# EAGLE design M900 (EAGLE 6.6.0)
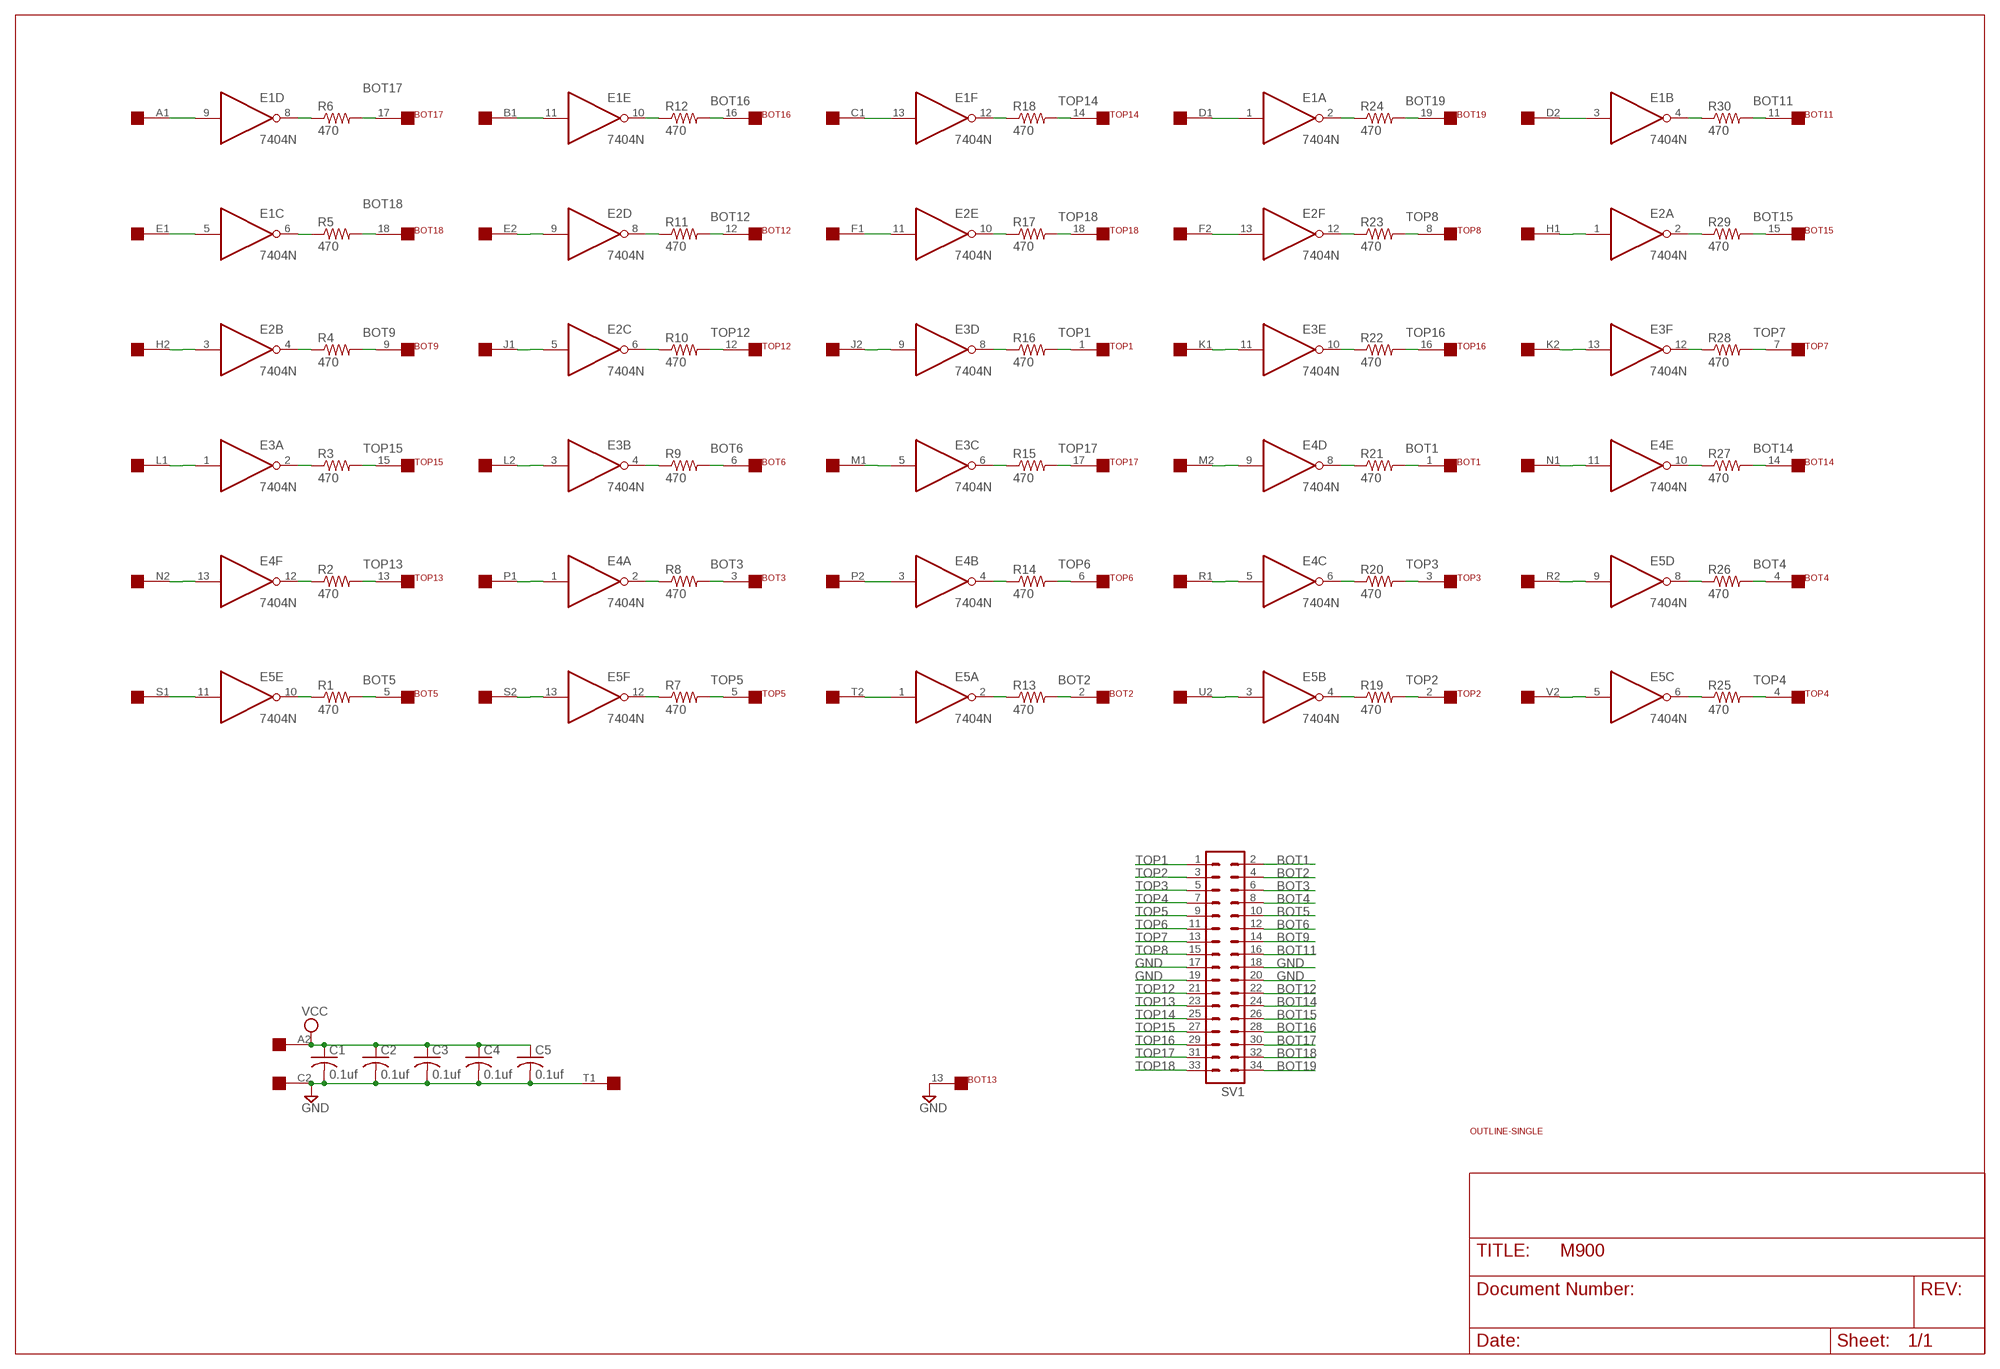
[diagram p0: schematic, sheet 1]

## Parts
BOT  FLEX19  [FLEX19]
C1  0.1uf  C-US050-025X075  [C050-025X075]
C2  0.1uf  C-US050-025X075  [C050-025X075]
C3  0.1uf  C-US050-025X075  [C050-025X075]
C4  0.1uf  C-US050-025X075  [C050-025X075]
C5  0.1uf  C-US050-025X075  [C050-025X075]
E1  7404N  [DIL14]
E2  7404N  [DIL14]
E3  7404N  [DIL14]
E4  7404N  [DIL14]
E5  7404N  [DIL14]
EDGE  SINGLE  [EDGE-CON2]
R1  470  R-US_0207/10  [0207/10]
R2  470  R-US_0207/10  [0207/10]
R3  470  R-US_0207/10  [0207/10]
R4  470  R-US_0207/10  [0207/10]
R5  470  R-US_0207/10  [0207/10]
R6  470  R-US_0207/10  [0207/10]
R7  470  R-US_0207/10  [0207/10]
R8  470  R-US_0207/10  [0207/10]
R9  470  R-US_0207/10  [0207/10]
R10  470  R-US_0207/10  [0207/10]
R11  470  R-US_0207/10  [0207/10]
R12  470  R-US_0207/10  [0207/10]
R13  470  R-US_0207/10  [0207/10]
R14  470  R-US_0207/10  [0207/10]
R15  470  R-US_0207/10  [0207/10]
R16  470  R-US_0207/10  [0207/10]
R17  470  R-US_0207/10  [0207/10]
R18  470  R-US_0207/10  [0207/10]
R19  470  R-US_0207/10  [0207/10]
R20  470  R-US_0207/10  [0207/10]
R21  470  R-US_0207/10  [0207/10]
R22  470  R-US_0207/10  [0207/10]
R23  470  R-US_0207/10  [0207/10]
R24  470  R-US_0207/10  [0207/10]
R25  470  R-US_0207/10  [0207/10]
R26  470  R-US_0207/10  [0207/10]
R27  470  R-US_0207/10  [0207/10]
R28  470  R-US_0207/10  [0207/10]
R29  470  R-US_0207/10  [0207/10]
R30  470  R-US_0207/10  [0207/10]
SV1  MA17-2  [MA17-2]
TOP  FLEX19  [FLEX19]
U$2  OUTLINE-SINGLE  [SINGLE]

## Nets
BOT1: BOT.1 R21.2 SV1.2
BOT2: BOT.2 R13.2 SV1.4
BOT3: BOT.3 R8.2 SV1.6
BOT4: BOT.4 R26.2 SV1.8
BOT5: BOT.5 R1.2 SV1.10
BOT6: BOT.6 R9.2 SV1.12
BOT9: BOT.9 R4.2 SV1.14
BOT11: BOT.11 R30.2 SV1.16
BOT12: BOT.12 R11.2 SV1.22
BOT14: BOT.14 R27.2 SV1.24
BOT15: BOT.15 R29.2 SV1.26
BOT16: BOT.16 R12.2 SV1.28
BOT17: BOT.17 R6.2 SV1.30
BOT18: BOT.18 R5.2 SV1.32
BOT19: BOT.19 R24.2 SV1.34
GND [supply]: BOT.13 C1.2 C2.2 C3.2 C4.2 C5.2 EDGE.C2 EDGE.T1 SV1.17 SV1.18 SV1.19 SV1.20
N$1: E1.9(D:I) EDGE.A1
N$2: E1.8(D:O) R6.1
N$3: E1.6(C:O) R5.1
N$4: E2.4(B:O) R4.1
N$5: E3.2(A:O) R3.1
N$6: E4.12(F:O) R2.1
N$7: E2.3(B:I) EDGE.H2
N$8: E5.11(E:I) EDGE.S1
N$9: E4.13(F:I) EDGE.N2
N$10: E3.1(A:I) EDGE.L1
N$11: E1.5(C:I) EDGE.E1
N$12: E4.1(A:I) EDGE.P1
N$13: E1.11(E:I) EDGE.B1
N$14: E2.9(D:I) EDGE.E2
N$15: E2.5(C:I) EDGE.J1
N$16: E3.3(B:I) EDGE.L2
N$17: E5.13(F:I) EDGE.S2
N$18: E4.2(A:O) R8.1
N$19: E3.4(B:O) R9.1
N$20: E2.6(C:O) R10.1
N$21: E2.8(D:O) R11.1
N$22: E1.10(E:O) R12.1
N$23: E5.12(F:O) R7.1
N$24: E5.10(E:O) R1.1
N$25: E4.3(B:I) EDGE.P2
N$26: E1.13(F:I) EDGE.C1
N$27: E2.11(E:I) EDGE.F1
N$28: E3.9(D:I) EDGE.J2
N$29: E3.5(C:I) EDGE.M1
N$30: E5.1(A:I) EDGE.T2
N$31: E5.2(A:O) R13.1
N$32: E4.4(B:O) R14.1
N$33: E3.6(C:O) R15.1
N$34: E3.8(D:O) R16.1
N$35: E1.12(F:O) R18.1
N$36: E2.10(E:O) R17.1
N$37: E5.4(B:O) R19.1
N$38: E4.6(C:O) R20.1
N$39: E4.8(D:O) R21.1
N$40: E3.10(E:O) R22.1
N$41: E2.12(F:O) R23.1
N$42: E1.2(A:O) R24.1
N$43: E4.5(C:I) EDGE.R1
N$44: E2.13(F:I) EDGE.F2
N$45: E3.11(E:I) EDGE.K1
N$46: E4.9(D:I) EDGE.M2
N$47: E5.3(B:I) EDGE.U2
N$48: E5.9(D:I) EDGE.R2
N$49: E1.1(A:I) EDGE.D1
N$50: E1.3(B:I) EDGE.D2
N$51: E2.1(A:I) EDGE.H1
N$52: E3.13(F:I) EDGE.K2
N$53: E4.11(E:I) EDGE.N1
N$54: E5.5(C:I) EDGE.V2
N$55: E5.6(C:O) R25.1
N$56: E5.8(D:O) R26.1
N$57: E4.10(E:O) R27.1
N$58: E3.12(F:O) R28.1
N$59: E2.2(A:O) R29.1
N$60: E1.4(B:O) R30.1
TOP1: R16.2 SV1.1 TOP.1
TOP2: R19.2 SV1.3 TOP.2
TOP3: R20.2 SV1.5 TOP.3
TOP4: R25.2 SV1.7 TOP.4
TOP5: R7.2 SV1.9 TOP.5
TOP6: R14.2 SV1.11 TOP.6
TOP7: R28.2 SV1.13 TOP.7
TOP8: R23.2 SV1.15 TOP.8
TOP12: R10.2 SV1.21 TOP.12
TOP13: R2.2 SV1.23 TOP.13
TOP14: R18.2 SV1.25 TOP.14
TOP15: R3.2 SV1.27 TOP.15
TOP16: R22.2 SV1.29 TOP.16
TOP17: R15.2 SV1.31 TOP.17
TOP18: R17.2 SV1.33 TOP.18
VCC [supply]: C1.1 C2.1 C3.1 C4.1 C5.1 EDGE.A2
Unconnected: BOT.7 BOT.8 BOT.10 EDGE.B2 EDGE.U1 EDGE.V1 TOP.9 TOP.10 TOP.11 TOP.19

## Power pins joined to a net without a drawn wire
GND: E1.7(P:GND) E2.7(P:GND) E3.7(P:GND) E4.7(P:GND) E5.7(P:GND)
VCC: E1.14(P:VCC) E2.14(P:VCC) E3.14(P:VCC) E4.14(P:VCC) E5.14(P:VCC)

## Library data of the parts
BOT TOP = dec-con:FLEX19: 19 pin Flexprint Connection
C1-C5 = rcl:C-US: CAPACITOR, American symbol
E1-E5 = 74xx-us:74*04: Hex INVERTER
EDGE = dec-con:SINGLE: Single-Height DEC board
R1-R30 = rcl:R-US_: RESISTOR, American symbol
SV1 = con-lstb:MA17-2: PIN HEADER; OC_FARNELL: unknown; OC_NEWARK: unknown
U$2 = dec-con:OUTLINE-*: Board outlines for DEC boards.

## Net classes
0 default: width 0.381 mm
1 supply: width 0.762 mm

## Board
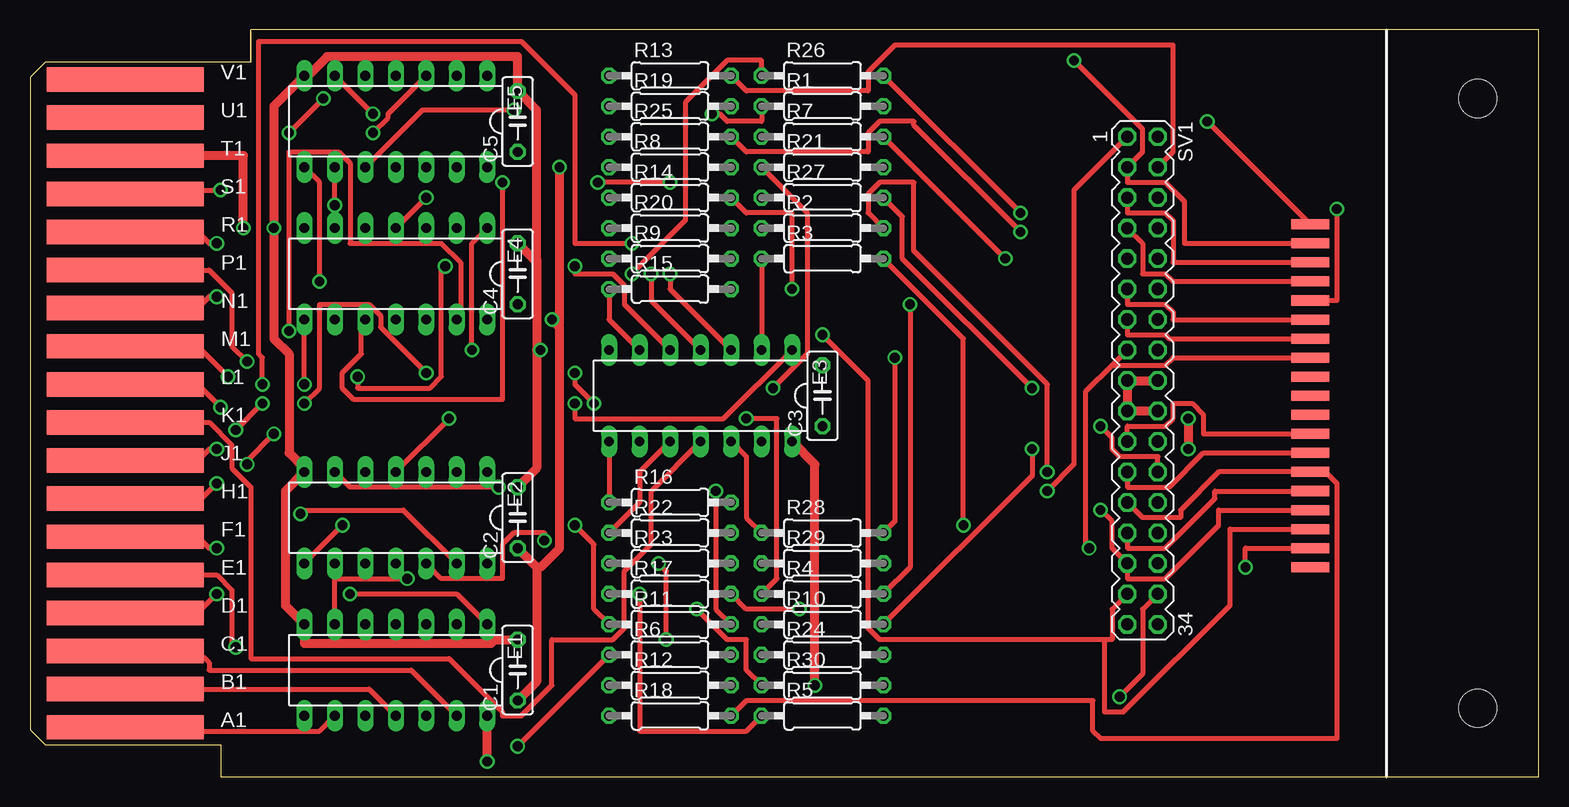
[diagram p1: board, top side]
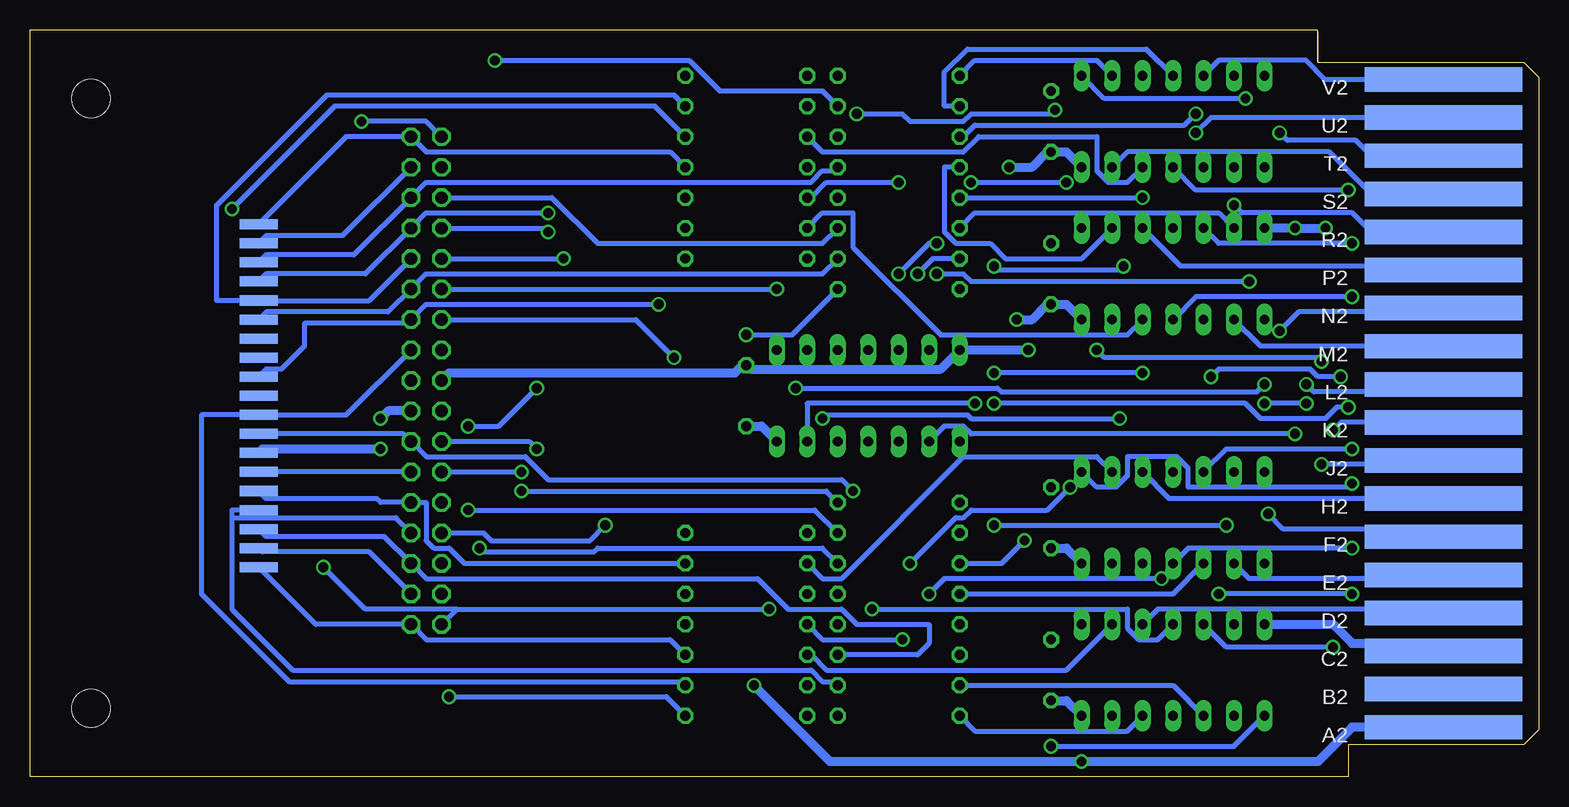
[diagram p2: board, bottom side, seen from below]

Size 125.73 x 62.23 mm. Coordinates in mm from the lower left corner, seen from the top.
Copper layers (1+16): Top 0.035mm / dielectric 1.5mm / Bottom 0.035mm
Design rules "16mils": minimum track width 16mil, minimum drill 32mil, track to track 15mil, track to pad 10mil, pad to pad 10mil, via to via 10mil, smd to smd 10mil, copper to edge 13mil, drill to drill 10mil, minimum pad ring 10mil, minimum via ring 8mil, stop-mask expansion 0mil, vias tented up to drill 0mil, thermal gap 10mil

### Footprints (pad centres in the part's own frame; a part is rotated, then mirrored left to right if it is on the bottom)
FLEX19 = smd 3.175 x 0.838: 1 0,14.287; 2 0,12.7; 3 0,11.113; 4 0,9.525; 5 0,7.938; 6 0,6.35; 7 0,4.763; 8 0,3.175; 9 0,1.587; 10 0,0; 11 0,-1.587; 12 0,-3.175; 13 0,-4.763; 14 0,-6.35; 15 0,-7.938; 16 0,-9.525; 17 0,-11.113; 18 0,-12.7; 19 0,-14.287
C050-025X075 = drill 0.813 octagon: 1 -2.54,0; 2 2.54,0
DIL14 = drill 0.813 long: 1 -7.62,-3.81; 2 -5.08,-3.81; 3 -2.54,-3.81; 4 0,-3.81; 5 2.54,-3.81; 6 5.08,-3.81; 7 7.62,-3.81; 8 7.62,3.81; 9 5.08,3.81; 10 2.54,3.81; 11 0,3.81; 12 -2.54,3.81; 13 -5.08,3.81; 14 -7.62,3.81
EDGE-CON2 = smd 13.106 x 2.032: A1 7.938,4.128; B1 7.938,7.303; C1 7.938,10.477; D1 7.938,13.652; E1 7.938,16.828; F1 7.938,20.003; H1 7.938,23.177; J1 7.938,26.352; K1 7.938,29.527; L1 7.938,32.703; M1 7.938,35.877; N1 7.938,39.053; P1 7.938,42.227; R1 7.938,45.403; S1 7.938,48.578; T1 7.938,51.752; U1 7.938,54.928; V1 7.938,58.102 | smd 13.106 x 2.032 bottom: A2 7.938,4.128; B2 7.938,7.303; C2 7.938,10.477; D2 7.938,13.652; E2 7.938,16.828; F2 7.938,20.003; H2 7.938,23.177; J2 7.938,26.352; K2 7.938,29.527; L2 7.938,32.703; M2 7.938,35.877; N2 7.938,39.053; P2 7.938,42.227; R2 7.938,45.403; S2 7.938,48.578; T2 7.938,51.752; U2 7.938,54.928; V2 7.938,58.102
0207/10 = drill 0.813 octagon: 1 -5.08,0; 2 5.08,0
MA17-2 = drill 1.016 octagon: 1 -20.32,-1.27; 2 -20.32,1.27; 3 -17.78,-1.27; 4 -17.78,1.27; 5 -15.24,-1.27; 6 -15.24,1.27; 7 -12.7,-1.27; 8 -12.7,1.27; 9 -10.16,-1.27; 10 -10.16,1.27; 11 -7.62,-1.27; 12 -7.62,1.27; 13 -5.08,-1.27; 14 -5.08,1.27; 15 -2.54,-1.27; 16 -2.54,1.27; 17 0,-1.27; 18 0,1.27; 19 2.54,-1.27; 20 2.54,1.27; 21 5.08,-1.27; 22 5.08,1.27; 23 7.62,-1.27; 24 7.62,1.27; 25 10.16,-1.27; 26 10.16,1.27; 27 12.7,-1.27; 28 12.7,1.27; 29 15.24,-1.27; 30 15.24,1.27; 31 17.78,-1.27; 32 17.78,1.27; 33 20.32,-1.27; 34 20.32,1.27
SINGLE = hole 3.175: 120.65,56.515; 120.65,5.715

### Placement (x,y rotation side)
BOT  106.68,31.75 0 bottom
C1  40.64,8.89 90 top
C2  40.64,21.59 90 top
C3  66.04,31.75 90 top
C4  40.64,41.91 90 top
C5  40.64,54.61 90 top
E1  30.48,8.89 180 top
E2  30.48,21.59 180 top
E3  55.88,31.75 180 top
E4  30.48,41.91 180 top
E5  30.48,54.61 180 top
EDGE  0,0 0 top
R1  66.04,55.88 0 top
R2  66.04,45.72 0 top
R3  66.04,43.18 0 top
R4  66.04,15.24 0 top
R5  66.04,5.08 0 top
R6  53.34,10.16 0 top
R7  66.04,53.34 0 top
R8  53.34,50.8 0 top
R9  53.34,43.18 0 top
R10  66.04,12.7 0 top
R11  53.34,12.7 0 top
R12  53.34,7.62 0 top
R13  53.34,58.42 0 top
R14  53.34,48.26 0 top
R15  53.34,40.64 0 top
R16  53.34,22.86 0 top
R17  53.34,15.24 0 top
R18  53.34,5.08 0 top
R19  53.34,55.88 0 top
R20  53.34,45.72 0 top
R21  66.04,50.8 0 top
R22  53.34,20.32 0 top
R23  53.34,17.78 0 top
R24  66.04,10.16 0 top
R25  53.34,53.34 0 top
R26  66.04,58.42 0 top
R27  66.04,48.26 0 top
R28  66.04,20.32 0 top
R29  66.04,17.78 0 top
R30  66.04,7.62 0 top
SV1  92.71,33.02 270 top
TOP  106.68,31.75 0 top
U$2  0,0 0 top

### Tracks (layer width: path | path; a pad name or v marks a point on that pad's centre or on a via)
BOT1
  Bottom 0.406: R21.2 72.39,52.07 92.71,52.07 SV1.2 99.38,53.34 BOT.1
BOT2
  Top 0.406: R13.2 59.69,57.15 69.85,57.15 69.85,58.74 72.07,60.96 95.25,60.96 95.25,52.07 SV1.4
  Bottom 0.406: BOT.2 106.05,45.09 99.7,45.09 SV1.4
BOT3
  Bottom 0.406: R8.2 58.74,50.48 59.69,50.48 60.64,49.53 92.71,49.53 SV1.6 98.74,43.5 106.05,43.5 BOT.3
BOT4  (via drill 0.81)
  Top 0.406: v82.55,46.99 R26.2
  Bottom 0.406: v82.55,46.99 92.71,46.99 SV1.8 97.79,41.91 106.05,41.91 BOT.4
BOT5
  Bottom 0.406: R1.2 72.07,56.83 100.97,56.83 110.17,47.62 110.17,39.69 BOT.5 97.47,39.69 SV1.10
BOT6
  Bottom 0.406: R9.2 59.69,41.91 92.71,41.91 SV1.12 95.89,38.73 106.05,38.73 BOT.6
BOT9  (via drill 0.81)
  Top 0.406: R4.2 73.34,17.46 v73.34,39.37
  Bottom 0.406: v73.34,39.37 92.71,39.37 SV1.14 94.3,37.78 102.87,37.78 102.87,35.88 104.78,33.97 106.05,33.97 BOT.9
BOT11
  Bottom 0.406: R30.2 71.44,7.94 104.14,7.94 111.44,15.24 111.44,30.16 BOT.11 99.38,30.16 SV1.16
BOT12  (via drill 0.81)
  Top 0.406: R11.2 57.15,13.97 v57.15,23.81
  Bottom 0.406: v57.15,23.81 58.1,24.77 82.55,24.77 84.46,26.67 92.71,26.67 SV1.22 94.62,28.57 BOT.12
BOT14  (via drill 0.81)
  Top 0.406: R27.2 72.71,46.67 72.71,43.18 v83.5,32.38 | v89.22,29.21 90.17,28.26 90.17,27.3 90.81,26.67 93.98,26.67 SV1.24
  Bottom 0.406: v83.5,32.38 86.68,29.21 v89.22,29.21 | SV1.24 BOT.14
BOT15
  Bottom 0.406: R29.2 89.54,17.78 90.81,19.05 92.08,19.05 92.71,19.68 92.71,22.86 SV1.26 96.52,22.86 96.84,23.18 106.05,23.18 BOT.15
BOT16
  Bottom 0.406: R12.2 58.74,7.94 59.69,7.94 60.64,8.89 103.82,8.89 108.9,13.97 108.9,21.59 | 108.9,21.59 108.9,22.23 BOT.16 | SV1.28 95.25,21.59 108.9,21.59
BOT17
  Bottom 0.406: R6.2 51.75,10.16 50.8,11.11 50.8,12.7 56.83,12.7 58.1,13.97 62.55,13.97 65.09,16.51 92.71,16.51 SV1.30 96.2,20 106.05,20 BOT.17
BOT18  (via drill 0.81)
  Top 0.406: v90.81,6.67 92.71,8.57 92.71,13.97 SV1.32
  Bottom 0.406: R5.2 72.71,6.67 v90.81,6.67 | BOT.18 106.36,18.73 97.47,18.73 SV1.32
BOT19
  Bottom 0.406: R24.2 72.39,11.43 92.71,11.43 SV1.34 101.92,12.7 BOT.19
GND  (via drill 0.81)
  Top 0.762: SV1.20 91.76,30.48 SV1.19 SV1.17 91.76,33.02 SV1.18 | v96.52,29.84 v96.52,27.3 | C1.2 38.74,11.43 38.42,11.11 22.86,11.11 22.86,12.38 E1.7 21.27,14.29 21.27,23.81 E2.7 22.86,25.72 21.59,26.99 21.59,35.24 20.32,36.51 20.32,45.4 v20.32,45.72 20.32,55.88 E5.7 23.18,58.42 24.77,60.01 40.64,60.01 40.64,57.47 C5.2 42.23,55.56 42.23,43.18 42.23,42.86 | C2.2 42.23,25.72 42.23,35.56 | 42.23,42.86 42.23,35.56 | C4.2 42.23,42.86 | EDGE.T1 17.78,51.75 v17.78,45.72 | v42.55,35.56 42.23,35.56
  Bottom 0.762: BOT.13 106.36,27.3 v96.52,27.3 | v96.52,29.84 95.89,30.48 SV1.20 | SV1.17 90.81,33.66 66.99,33.66 66.36,34.29 C3.2 65.72,33.97 49.85,33.97 E3.7 47.94,35.56 v42.55,35.56 | EDGE.C2 8.57,11.11 15.56,11.11 17.15,12.7 E1.7 | E4.7 v20.32,45.72 20,45.72 v17.78,45.72
N$1
  Top 0.406: E1.9 24.13,3.81 7.94,3.81 EDGE.A1
N$2  (via drill 0.81)
  Top 0.406: R6.1 v40.64,2.54
  Bottom 0.406: E1.8 25.4,2.54 v40.64,2.54
N$3  (via drill 0.81)
  Top 0.406: R5.1 59.69,3.81 50.8,3.81 v50.8,15.24 | v31.43,16.51 25.4,16.51 E1.6
  Bottom 0.406: v50.8,15.24 49.53,16.51 v31.43,16.51
N$4  (via drill 0.81)
  Top 0.406: v34.93,29.84 E2.4 | v59.69,29.84 62.23,29.84 62.23,16.51 R4.1
  Bottom 0.406: v34.93,29.84 47.31,29.84 47.63,30.16 59.37,30.16 v59.69,29.84
N$5
  Top 0.406: R3.1 E3.2
N$6
  Bottom 0.406: E4.12 34.29,36.83 49.85,36.83 57.15,44.13 57.15,46.99 59.69,46.99 R2.1
N$7
  Bottom 0.406: E2.3 30.8,23.18 EDGE.H2
N$8  (via drill 0.81)
  Top 0.406: v15.88,48.9 7.94,48.9 EDGE.S1
  Bottom 0.406: E5.11 28.58,48.9 v15.88,48.9
N$9  (via drill 0.81)
  Top 0.406: E4.13 35.88,38.42 35.88,42.86 34.29,44.45 26.67,44.45 26.67,51.12 25.72,52.07 21.59,52.07 v21.59,37.15
  Bottom 0.406: v21.59,37.15 20,38.73 8.26,38.73 EDGE.N2
N$10  (via drill 0.81)
  Top 0.406: E3.1 57.79,29.84 45.4,29.84 v45.4,31.11 | v15.88,30.8 13.97,32.7 EDGE.L1
  Bottom 0.406: v45.4,31.11 24.45,31.11 23.18,29.84 17.78,29.84 16.83,30.8 v15.88,30.8
N$11  (via drill 0.81)
  Top 0.406: v17.15,10.79 16.83,11.11 16.83,15.56 15.56,16.83 EDGE.E1
  Bottom 0.406: E1.5 26.04,10.79 v17.15,10.79
N$12  (via drill 0.81)
  Top 0.406: E4.1 36.83,44.45 v36.83,35.56 | v18.1,34.61 16.83,35.88 16.83,40.32 14.92,42.23 EDGE.P1
  Bottom 0.406: v36.83,35.56 36.2,34.92 18.42,34.92 v18.1,34.61
N$13
  Top 0.406: E1.11 28.26,7.3 EDGE.B1
N$14
  Bottom 0.406: E2.9 24.13,16.51 8.26,16.51 EDGE.E2
N$15  (via drill 0.81)
  Top 0.406: v15.56,27.3 14.92,27.3 13.97,26.35 EDGE.J1
  Bottom 0.406: E2.5 26.04,27.3 v15.56,27.3
N$16  (via drill 0.81)
  Top 0.406: E3.3 53.34,40.64 v53.34,41.91 | v50.17,44.45 45.4,44.45 45.4,56.83 40.96,61.28 19.05,61.28 19.05,35.24 19.37,34.92 v19.37,32.7
  Bottom 0.406: v53.34,41.91 50.8,44.45 v50.17,44.45 | v19.37,32.7 18.73,32.07 8.57,32.07 EDGE.L2
N$17
  Bottom 0.406: E5.13 34.29,52.07 17.46,52.07 13.97,48.58 EDGE.S2
N$18
  Bottom 0.406: E4.2 38.1,43.18 44.45,43.18 45.72,44.45 48.58,44.45 49.53,45.4 49.53,50.8 R8.1
N$19  (via drill 0.81)
  Top 0.406: E3.4 51.75,39.69 v51.75,41.91
  Bottom 0.406: v51.75,41.91 50.48,43.18 R9.1
N$20  (via drill 0.81)
  Top 0.406: E2.6 26.67,24.13 v39.05,24.13 | v52.39,17.78 53.02,17.14 v53.02,11.43
  Bottom 0.406: v39.05,24.13 40.96,22.23 47.31,22.23 47.94,21.59 48.58,21.59 v52.39,17.78 | v53.02,11.43 59.69,11.43 R10.1
N$21  (via drill 0.81)
  Top 0.406: v26.04,20.95 E2.8 | v45.4,20.95 46.99,19.37 46.99,13.97 R11.1
  Bottom 0.406: v45.4,20.95 v26.04,20.95
N$22
  Bottom 0.406: E1.10 30.48,7.62 R12.1
N$23
  Bottom 0.406: E5.12 34.29,49.53 35.88,49.53 36.83,50.48 36.83,53.34 46.67,53.34 47.94,52.07 59.69,52.07 R7.1
N$24  (via drill 0.81)
  Top 0.406: E5.10 32.7,55.56 v40.32,55.56 | v56.83,55.24 57.47,55.24 58.1,54.61 60.96,54.61 R1.1
  Bottom 0.406: v40.32,55.56 40.64,55.24 47.31,55.24 47.94,54.61 52.39,54.61 53.02,55.24 v56.83,55.24
N$25
  Bottom 0.406: E4.3 29.85,42.55 8.26,42.55 EDGE.P2
N$26
  Top 0.406: E1.13 31.75,8.89 14.92,8.89 14.92,9.53 13.97,10.48 EDGE.C1
N$27  (via drill 0.81)
  Top 0.406: v15.56,19.05 14.92,19.05 13.97,20 EDGE.F1
  Bottom 0.406: E2.11 29.21,19.05 v15.56,19.05
N$28  (via drill 0.81)
  Top 0.406: v20.32,28.57 18.1,26.35 v18.1,26.04
  Bottom 0.406: E3.9 49.53,29.21 47.94,29.21 47.31,28.57 v20.32,28.57 | v18.1,26.04 8.26,26.04 EDGE.J2
N$29  (via drill 0.81)
  Top 0.406: E3.5 49.53,39.37 49.53,40.96 48.58,41.91 45.4,41.91 v45.4,42.55 | v34.61,42.55 34.29,42.23 34.29,33.34 33.34,32.38 27.31,32.38 v27.31,33.34 | v16.51,33.34 13.97,35.88 EDGE.M1
  Bottom 0.406: v45.4,42.55 45.09,42.23 34.93,42.23 v34.61,42.55 | v27.31,33.34 26.67,33.97 19.05,33.97 18.42,33.34 v16.51,33.34
N$30  (via drill 0.81)
  Top 0.406: v21.59,53.66 v24.45,56.52
  Bottom 0.406: E5.1 36.2,56.52 v24.45,56.52 | v21.59,53.66 20.96,53.02 15.24,53.02 13.97,51.75 EDGE.T2
N$31
  Bottom 0.406: E5.2 36.83,59.69 46.99,59.69 R13.1
N$32  (via drill 0.81)
  Top 0.406: v33.02,48.26 E4.4
  Bottom 0.406: R14.1 v33.02,48.26
N$33
  Top 0.406: E3.6 48.26,38.1 R15.1
N$34
  Top 0.406: E3.8 R16.1
N$35
  Bottom 0.406: E1.12 34.29,3.81 46.99,3.81 R18.1
N$36
  Bottom 0.406: E2.10 30.48,15.24 R17.1
N$37
  Bottom 0.406: E5.4 32.7,60.64 47.63,60.64 49.53,58.74 49.53,55.88 R19.1
N$38
  Bottom 0.406: E4.6 26.67,46.99 46.99,46.99 R20.1
N$39  (via drill 0.81)
  Top 0.406: v22.86,32.7 E4.8 | v61.91,32.38 64.77,35.24 64.77,46.99 R21.1
  Bottom 0.406: v22.86,32.7 23.5,32.07 44.77,32.07 45.09,32.38 v61.91,32.38
N$40
  Top 0.406: R22.1 50.8,22.86 50.8,25.4 E3.10
N$41  (via drill 0.81)
  Top 0.406: E2.12 34.29,16.51 39.37,16.51 39.37,19.37 40.32,20.32 42.86,20.32 v42.86,19.68
  Bottom 0.406: v42.86,19.68 44.77,17.78 R23.1
N$42
  Bottom 0.406: E1.2 39.37,8.89 59.37,8.89 60.64,10.16 R24.1
N$43  (via drill 0.81)
  Top 0.406: v15.56,44.45 14.92,44.45 13.97,45.4 EDGE.R1
  Bottom 0.406: E4.5 26.67,44.45 v15.56,44.45
N$44  (via drill 0.81)
  Top 0.406: E2.13 31.12,22.23 22.54,22.23 v22.54,21.91
  Bottom 0.406: v22.54,21.91 21.27,20.64 8.57,20.64 EDGE.F2
N$45
  Top 0.406: E3.11 51.75,23.81 51.75,19.37 49.53,17.14 49.53,12.38 48.58,11.43 43.5,11.43 43.5,7.62 40.96,5.08 39.37,5.08 39.37,5.4 34.93,9.84 18.42,9.84 18.42,24.13 16.83,25.72 16.83,27.62 14.92,29.53 EDGE.K1
N$46
  Bottom 0.406: E4.9 23.18,35.88 EDGE.M2
N$47  (via drill 0.81)
  Top 0.406: E5.3 29.85,55.24 29.85,54.93 v28.58,53.66
  Bottom 0.406: v28.58,53.66 27.31,54.93 EDGE.U2
N$48  (via drill 0.81)
  Top 0.406: v25.4,47.62 E5.9
  Bottom 0.406: v25.4,47.62 24.77,46.99 15.56,46.99 13.97,45.4 EDGE.R2
N$49  (via drill 0.81)
  Top 0.406: E1.1 35.56,15.24 v26.67,15.24 | v15.56,15.24 13.97,13.65 EDGE.D1
  Bottom 0.406: v15.56,15.24 v26.67,15.24
N$50
  Bottom 0.406: E1.3 31.75,13.97 8.26,13.97 EDGE.D2
N$51  (via drill 0.81)
  Top 0.406: v15.56,24.45 14.29,23.18 EDGE.H1
  Bottom 0.406: E2.1 36.83,24.13 35.24,24.13 34.29,25.08 34.29,26.67 30.16,26.67 29.21,25.72 29.21,24.13 15.88,24.13 v15.56,24.45
N$52  (via drill 0.81)
  Top 0.406: v46.99,31.11 45.4,32.7 v45.4,33.66 | v33.02,33.66 29.21,37.47 29.21,38.42 28.26,39.37 24.13,39.37 24.13,32.38 v22.86,31.11 | v17.15,28.89 v19.37,31.11
  Bottom 0.406: E3.13 60.96,31.11 v46.99,31.11 | v33.02,33.66 v45.4,33.66 | v19.37,31.11 v22.86,31.11 | v17.15,28.89 16.51,29.53 EDGE.K2
N$53  (via drill 0.81)
  Top 0.406: v15.56,40.01 14.92,40.01 13.97,39.05 EDGE.N1
  Bottom 0.406: E4.11 28.58,40.01 v15.56,40.01
N$54
  Bottom 0.406: E5.5 26.67,59.69 19.37,59.69 17.78,58.1 EDGE.V2
N$55  (via drill 0.81)
  Top 0.406: v28.58,55.24 E5.6
  Bottom 0.406: v28.58,55.24 29.53,54.29 46.99,54.29 47.94,53.34 R25.1
N$56  (via drill 0.81)
  Top 0.406: E5.8 24.13,49.53 v24.13,41.27 | v50.17,41.91 54.61,46.35 54.61,56.2 58.1,59.69 60.96,59.69 R26.1
  Bottom 0.406: v24.13,41.27 47.31,41.27 47.94,41.91 v50.17,41.91
N$57  (via drill 0.81)
  Top 0.406: E4.10 27.62,37.78 27.62,35.24 26.04,33.66 26.04,32.38 26.99,31.43 39.37,31.43 v39.37,49.53 | v53.34,49.53 v47.31,49.53
  Bottom 0.406: v47.31,49.53 v39.37,49.53 | v53.34,49.53 59.37,49.53 60.64,48.26 R27.1
N$58
  Top 0.406: R28.1 59.69,21.59 59.69,26.67 E3.12
N$59
  Bottom 0.406: E2.2 36.83,26.67 47.94,26.67 58.1,16.51 59.69,16.51 R29.1
N$60  (via drill 0.81)
  Top 0.406: v55.56,13.97 58.1,11.43 59.69,11.43 59.69,8.89 R30.1
  Bottom 0.406: E1.4 31.75,11.43 33.34,11.43 34.29,12.38 34.29,13.97 v55.56,13.97
TOP1  (via drill 0.81)
  Top 0.406: v84.77,23.81 87,26.04 87,48.9 SV1.1 | v98.11,54.61 TOP.1
  Bottom 0.406: R16.2 59.37,23.81 v84.77,23.81 | v98.11,54.61 92.71,54.61 SV1.1
TOP2  (via drill 0.81)
  Top 0.406: v87,59.69 92.71,53.98 92.71,52.07 SV1.3 91.44,49.53 94.62,49.53 96.2,47.94 96.2,44.45 TOP.2
  Bottom 0.406: R19.2 59.69,57.15 68.26,57.15 70.8,59.69 v87,59.69
TOP3
  Top 0.406: TOP.3 95.25,42.86 95.25,46.35 94.62,46.99 91.44,46.99 SV1.5
  Bottom 0.406: R20.2 59.69,44.45 78.42,44.45 82.23,48.26 SV1.5
TOP4  (via drill 0.81)
  Top 0.406: R25.2 59.69,52.07 69.85,52.07 69.85,53.66 70.8,54.61 73.66,54.61 73.66,54.29 v82.55,45.4 | TOP.4 95.25,41.27 94.62,41.91 92.71,41.91 92.71,44.45 SV1.7
  Bottom 0.406: v82.55,45.4 82.87,45.72 SV1.7
TOP5  (via drill 0.81)
  Top 0.406: v81.28,43.18 R7.2 | TOP.5 108.9,39.69 v108.9,47.31
  Bottom 0.406: SV1.9 v81.28,43.18 | v108.9,47.31 100.33,55.88 73.66,55.88 R7.2
TOP6  (via drill 0.81)
  Top 0.406: R14.2 59.69,46.99 63.5,46.99 v63.5,40.64 | TOP.6 95.25,38.1 95.25,38.73 94.62,39.37 91.44,39.37 SV1.11
  Bottom 0.406: SV1.11 v63.5,40.64
TOP7  (via drill 0.81)
  Top 0.406: R28.2 72.07,21.27 v72.07,34.92 | TOP.7 94.93,36.51 94.62,36.83 91.44,36.83 SV1.13
  Bottom 0.406: v72.07,34.92 75.25,38.1 SV1.13
TOP8  (via drill 0.81)
  Top 0.406: v88.27,19.05 87.95,19.37 87.95,32.07 90.17,34.29 | SV1.15 90.17,34.29 | TOP.8 95.25,34.92 94.62,34.29 90.17,34.29
  Bottom 0.406: R23.2 59.69,19.05 78.42,19.05 78.74,18.73 87.95,18.73 v88.27,19.05
TOP12  (via drill 0.81)
  Top 0.406: R10.2 83.5,25.08 v83.5,27.3 | TOP.12 97.79,28.57 97.79,30.16 96.84,31.11 95.25,31.11 95.25,29.84 94.62,29.21 91.44,29.21 SV1.21
  Bottom 0.406: v83.5,27.3 84.14,27.94 SV1.21
TOP13  (via drill 0.81)
  Top 0.406: R2.2 69.85,46.99 69.85,48.58 70.8,49.53 73.66,49.53 73.66,43.81 84.77,32.7 v84.77,25.4 | TOP.13 97.79,26.99 94.93,24.13 91.44,24.13 SV1.23
  Bottom 0.406: SV1.23 v84.77,25.4
TOP14
  Top 0.406: R18.2 59.69,6.35 88.58,6.35 88.58,3.81 89.22,3.17 108.9,3.17 108.9,24.45 107.95,25.4 TOP.14 99.06,25.4 95.89,22.23 95.89,21.59 92.71,21.59 SV1.25
TOP15  (via drill 0.81)
  Top 0.406: R3.2 77.79,36.51 v77.79,20.95 | TOP.15 98.74,23.81 98.74,23.18 94.62,19.05 91.44,19.05 SV1.27
  Bottom 0.406: v77.79,20.95 79.06,19.68 87.31,19.68 87.95,20.32 SV1.27
TOP16  (via drill 0.81)
  Top 0.406: v89.22,22.23 90.17,21.27 90.17,19.05 SV1.29 91.44,16.51 94.62,16.51 99.06,20.95 99.06,22.23 TOP.16
  Bottom 0.406: R22.2 60.33,22.23 v89.22,22.23
TOP17  (via drill 0.81)
  Top 0.406: v66.04,36.83 69.85,33.02 69.85,12.38 70.8,11.43 89.54,11.43 | 89.54,11.43 90.17,11.43 90.17,13.97 SV1.31 | TOP.17 100.01,20.64 100.01,14.29 91.12,5.4 89.54,5.4 89.54,11.43
  Bottom 0.406: R15.2 62.23,36.83 v66.04,36.83
TOP18  (via drill 0.81)
  Top 0.406: R17.2 59.69,13.97 v64.14,13.97 | TOP.18 101.28,19.05 v101.28,17.46
  Bottom 0.406: 90.17,13.97 v64.14,13.97 | SV1.33 90.17,13.97 | v101.28,17.46 97.79,13.97 90.17,13.97
VCC  (via drill 0.81)
  Top 0.762: C1.1 42.23,7.94 42.23,17.46 | C2.1 42.23,17.46 | 43.97,37.62 44.13,37.47 44.13,19.05 42.55,17.46 42.23,17.46 | 43.97,37.62 v43.5,38.1 | v44.13,50.8 44.13,37.78 43.97,37.62 | E3.14 65.41,26.04 v65.41,7.62 | v38.1,1.27 E1.14
  Bottom 0.762: E5.14 39.37,52.07 C5.1 40.96,52.07 42.23,50.8 v44.13,50.8 | E4.14 39.37,39.37 C4.1 40.96,39.37 42.23,38.1 v43.5,38.1 | E1.14 39.37,6.35 C1.1 | E2.14 39.37,19.05 C2.1 | E3.14 64.77,29.21 C3.1 | v65.41,7.62 59.06,1.27 v38.1,1.27 18.42,1.27 15.56,4.13 EDGE.A2